# EAGLE schematic Carduino_v20 (EAGLE 9.0.1)
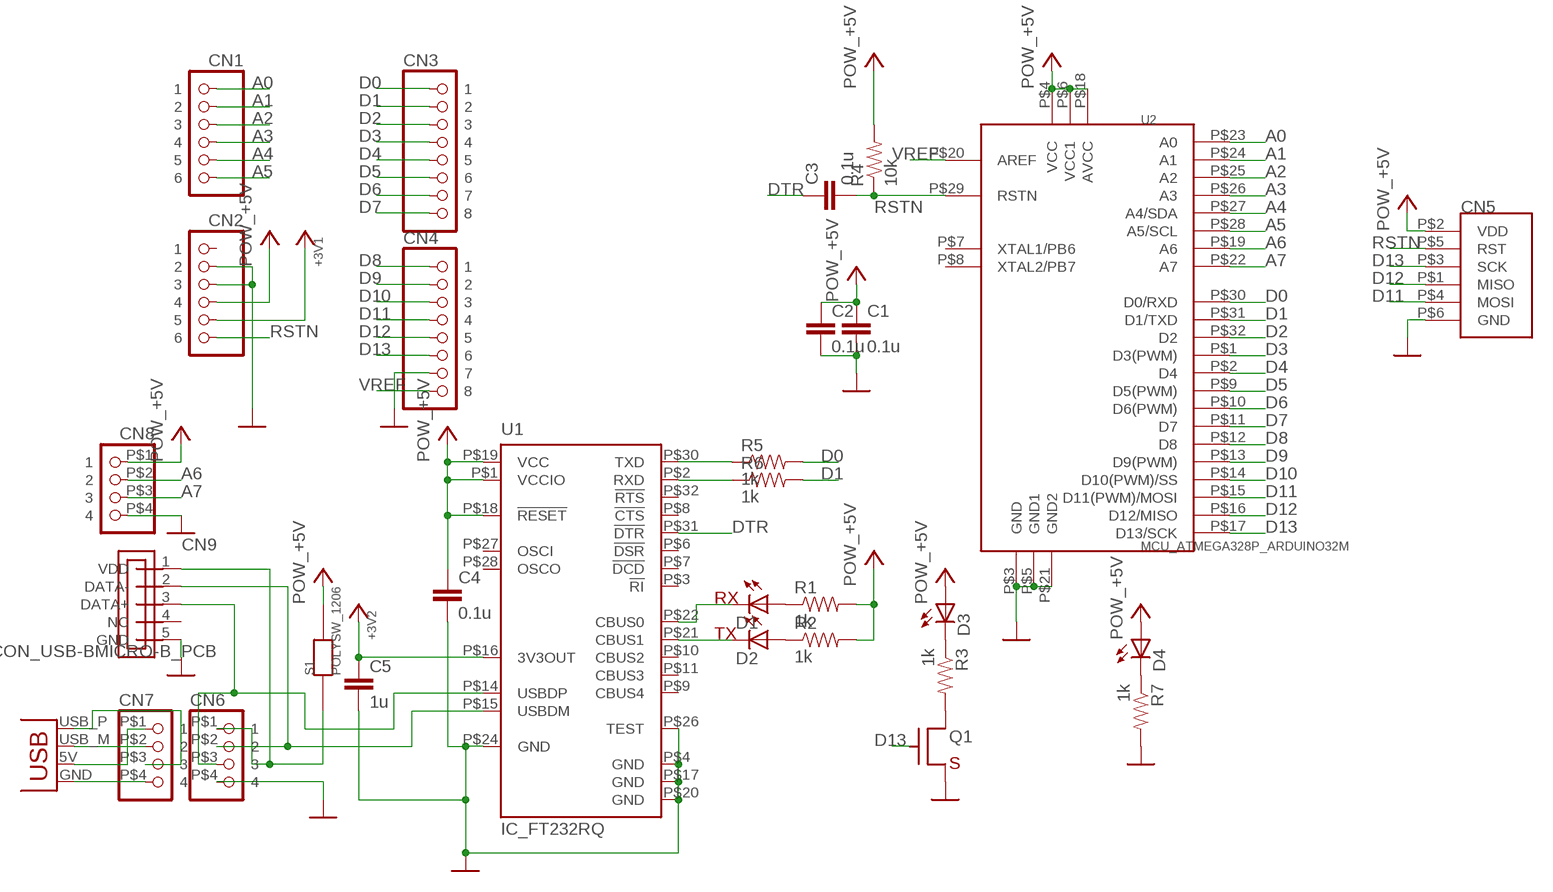
[diagram p0: schematic, sheet 1]

## Parts
C1  0.1u  CAP0603  [0603]
C2  0.1u  CAP0603  [0603]
C3  0.1u  CAP0603  [0603]
C4  0.1u  CAP0603  [0603]
C5  1u  CAP0603  [0603]
CN1  CON_PINHD-1X6SMD  [1X06SMD]
CN2  CON_PINHD-1X6SMD  [1X06SMD]
CN3  CON_PINHD-1X8SMD  [1X08SMD]
CN4  CON_PINHD-1X8SMD  [1X08SMD]
CN5  CON_AVRISPSMD  [2X3SMD]
CN6  CON_PINHD-1X4SMD  [1X04SMD]
CN7  CON_PINHD-1X4SMD  [1X04SMD]
CN8  CON_PINHD-1X4SMD  [1X04SMD]
CN9  CON_USB-BMICRO-B_PCB  [USB-MICRO-PCB]
D1  LED0603  [SPARKFUN_LED-0603]
D2  LED0603  [SPARKFUN_LED-0603]
D3  LED0603  [SPARKFUN_LED-0603]
D4  LED0603  [SPARKFUN_LED-0603]
JP2  CON_USBPCB  [USB-A-PCB]
Q1  TR_NMOS_IRLML6344  [SOT-23-3-2916]
R1  1k  RES0603  [0603]
R2  1k  RES0603  [0603]
R3  1k  RES0603  [0603]
R4  10k  RES0603  [0603]
R5  1k  RES0603  [0603]
R6  1k  RES0603  [0603]
R7  1k  RES0603  [0603]
S1  POLYSW_1206  [1206]
U1  IC_FT232RQ  [QFN32]
U2  MCU_ATMEGA328P_ARDUINO32M  [QFN32]

## Nets
+3V3: C5.1 CN2.P$5 U1.P$16(3V3OUT) ; supply symbol labelled POW_+3V3
+5V: C1.1 C2.1 C4.1 CN2.P$4 CN5.P$2(VDD) CN8.P$1 D3.A D4.A R1.2 R2.2 R4.2 S1.P$2 U1.P$1(VCCIO) U1.P$18(!RESET) U1.P$19(VCC) U2.P$4(VCC) U2.P$6(VCC1) U2.P$18(AVCC) ; supply symbol labelled POW_+5V
A0: CN1.P$1 U2.P$23(A0)
A1: CN1.P$2 U2.P$24(A1)
A2: CN1.P$3 U2.P$25(A2)
A3: CN1.P$4 U2.P$26(A3)
A4: CN1.P$5 U2.P$27(A4/SDA)
A5: CN1.P$6 U2.P$28(A5/SCL)
A6: CN8.P$2 U2.P$19(A6)
A7: CN8.P$3 U2.P$22(A7)
D0: CN3.P$1 R5.2 U2.P$30(D0/RXD)
D1: CN3.P$2 R6.2 U2.P$31(D1/TXD)
D2: CN3.P$3 U2.P$32(D2)
D3: CN3.P$4 U2.P$1(D3(PWM))
D4: CN3.P$5 U2.P$2(D4)
D5: CN3.P$6 U2.P$9(D5(PWM))
D6: CN3.P$7 U2.P$10(D6(PWM))
D7: CN3.P$8 U2.P$11(D7)
D8: CN4.P$1 U2.P$12(D8)
D9: CN4.P$2 U2.P$13(D9(PWM))
D10: CN4.P$3 U2.P$14(D10(PWM)/SS)
D11: CN4.P$4 CN5.P$4(MOSI) U2.P$15(D11(PWM)/MOSI)
D12: CN4.P$5 CN5.P$1(MISO) U2.P$16(D12/MISO)
D13: CN4.P$6 CN5.P$3(SCK) Q1.1(G) U2.P$17(D13/SCK)
DTR: C3.1 U1.P$31(!DTR)
GND: C1.2 C2.2 C4.2 C5.2 CN2.P$2 CN2.P$3 CN4.P$7 CN5.P$6(GND) CN6.P$4 CN8.P$4 CN9.5(GND) Q1.2(S) R7.2 U1.P$4(GND) U1.P$17(GND) U1.P$20(GND) U1.P$24(GND) U1.P$26(TEST) U2.P$3(GND) U2.P$5(GND1) U2.P$21(GND2) ; supply symbol labelled POW_GND
N$1: D1.A R1.1
N$2: D2.A R2.1
N$3: R5.1 U1.P$30(TXD)
N$4: R6.1 U1.P$2(RXD)
N$5: D1.C U1.P$22(CBUS0)
N$6: D2.C U1.P$21(CBUS1)
N$7: D3.C R3.1
N$8: CN6.P$2 CN9.2(DATA-) U1.P$15(USBDM)
N$9: CN7.P$4 JP2.GND
N$10: Q1.3(D) R3.2
N$11: CN7.P$1 JP2.5V(VBUS)
N$12: CN7.P$2 JP2.USB_M(D-)
N$13: CN7.P$3 JP2.USB_P(D+)
N$14: D4.C R7.1
N$17: CN6.P$3 CN9.3(DATA+) U1.P$14(USBDP)
N$18: CN6.P$1 CN9.1(VDD) S1.P$1
RSTN: C3.2 CN2.P$6 CN5.P$5(RST) R4.1 U2.P$29(RSTN)
VREF: CN4.P$8 U2.P$20(AREF)
Unconnected: CN2.P$1 CN9.4(NC) U1.P$3(!RI) U1.P$6(!DSR) U1.P$7(!DCD) U1.P$8(!CTS) U1.P$9(CBUS4) U1.P$10(CBUS2) U1.P$11(CBUS3) U1.P$27(OSCI) U1.P$28(OSCO) U1.P$32(!RTS) U2.P$7(XTAL1/PB6) U2.P$8(XTAL2/PB7)

## Notes on the sheet
- RX
- TX

## Library data of the parts
C1-C5 = akita:CAP: Capacitor Standard 0603 ceramic capacitor, and 0.1" leaded capacitor.
CN1 CN2 = akita:CON_PINHD-1X6: PIN HEADER
CN3 CN4 = akita:CON_PINHD-1X8: PIN HEADER
CN5 = akita:CON_AVRISP: AVR ISP standard 2x3 connector
CN6-CN8 = akita:CON_PINHD-1X4: PIN HEADER
CN9 = akita:CON_USB-B
D1-D4 = akita:LED: LEDs Standard schematic elements and footprints for 5mm, 3mm, 1206, and 0603 sized LEDs. 5mm - Spark Fun Electronics SKU : COM-00529 (and others)
JP2 = akita:CON_USB: USB Connectors USB-B-PTH is fully proven SKU : PRT-00139/CONN-08278 USB-miniB is fully proven SKU : PRT-00587 USB-A-PCB is untested. USB-A-H is throughly reviewed, but untested. Spark Fun Electronics SKU : PRT-00437 USB-B-SMT is throughly reviewed, but untested. Needs silkscreen touching up. USB-A-S has not been used/tested USB-MB-H has not been used/tested USB-MICROB has been used. CONN-09505
Q1 = akita:TR_NMOS_IRLML6344
R1-R7 = akita:RES: Resistor Basic schematic elements and footprints for 0603, 1206, and PTH resistors.
S1 = akita:POLYSW_1206
U1 = akita:IC_FT232R: Source: http://www.ftdichip.com/Documents/DataSheets/DS_FT232R_v104.pdf
U2 = akita:MCU_ATMEGA328P_ARDUINO: ATmega328P with Arduino's pin assignment